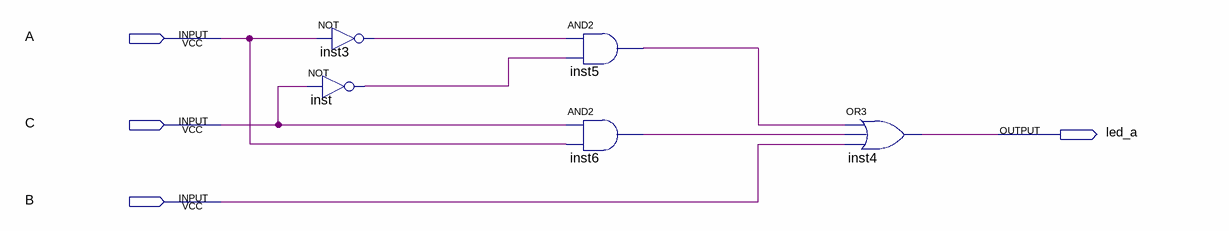
[diagram p0: schematic sheet]
// Quartus schematic led_a.bdf as structural Verilog: 5 symbols, 4 pins
module led_a (
  input  A,
  input  C,
  input  B,
  output led_a
);

  wire inst3_out, inst5_out, inst6_out, inst_out;

  not inst (inst_out, C);
  not inst3 (inst3_out, A);
  and inst5 (inst5_out, inst3_out, inst_out);
  and inst6 (inst6_out, C, A);
  or inst4 (led_a, inst5_out, inst6_out, B);
endmodule
